# Altium schematic sheet TestDeviceSch_Sheet1.SchDoc: Test Device
size 420 x 297 mm; Date: 6 Aug 2026; ApprovedBy: CLASSIFIED; CheckedBy: CLASSIFIED; Author: A. Lytovchenko; CompanyName: CLASSIFIED; DrawnBy: A. Lytovchenko; Engineer: A. Lytovchenko; Organization: CLASSIFIED; Address1: CLASSIFIED; Address2: CLASSIFIED; Address3: CLASSIFIED; Address4: CLASSIFIED; DocumentNumber: CLASSIFIED; Revision: 1; SheetNumber: 1; SheetTotal: 1; PCB_DWG_NO: CLASSIFIED; DOC_NO_FAB_DWG: CLASSIFIED; DOC_NO_ASSY_DWG: CLASSIFIED; DOC_NO_BOM: CLASSIFIED; SCH_SCALE: 1:1; CAGE_CODE: CLASSIFIED; DOC_NO_SCH_DWG: CLASSIFIED; ENG_APP_DATE: 6 Aug 2026; DSN_APP_DATE: 6 Aug 2026; CHK_APP_DATE: CLASSIFIED; Project: CLASSIFIED; DOC_NO_ASSY_: CLASSIFIED; Time: 00:00; Application_BuildNumber: CLASSIFIED
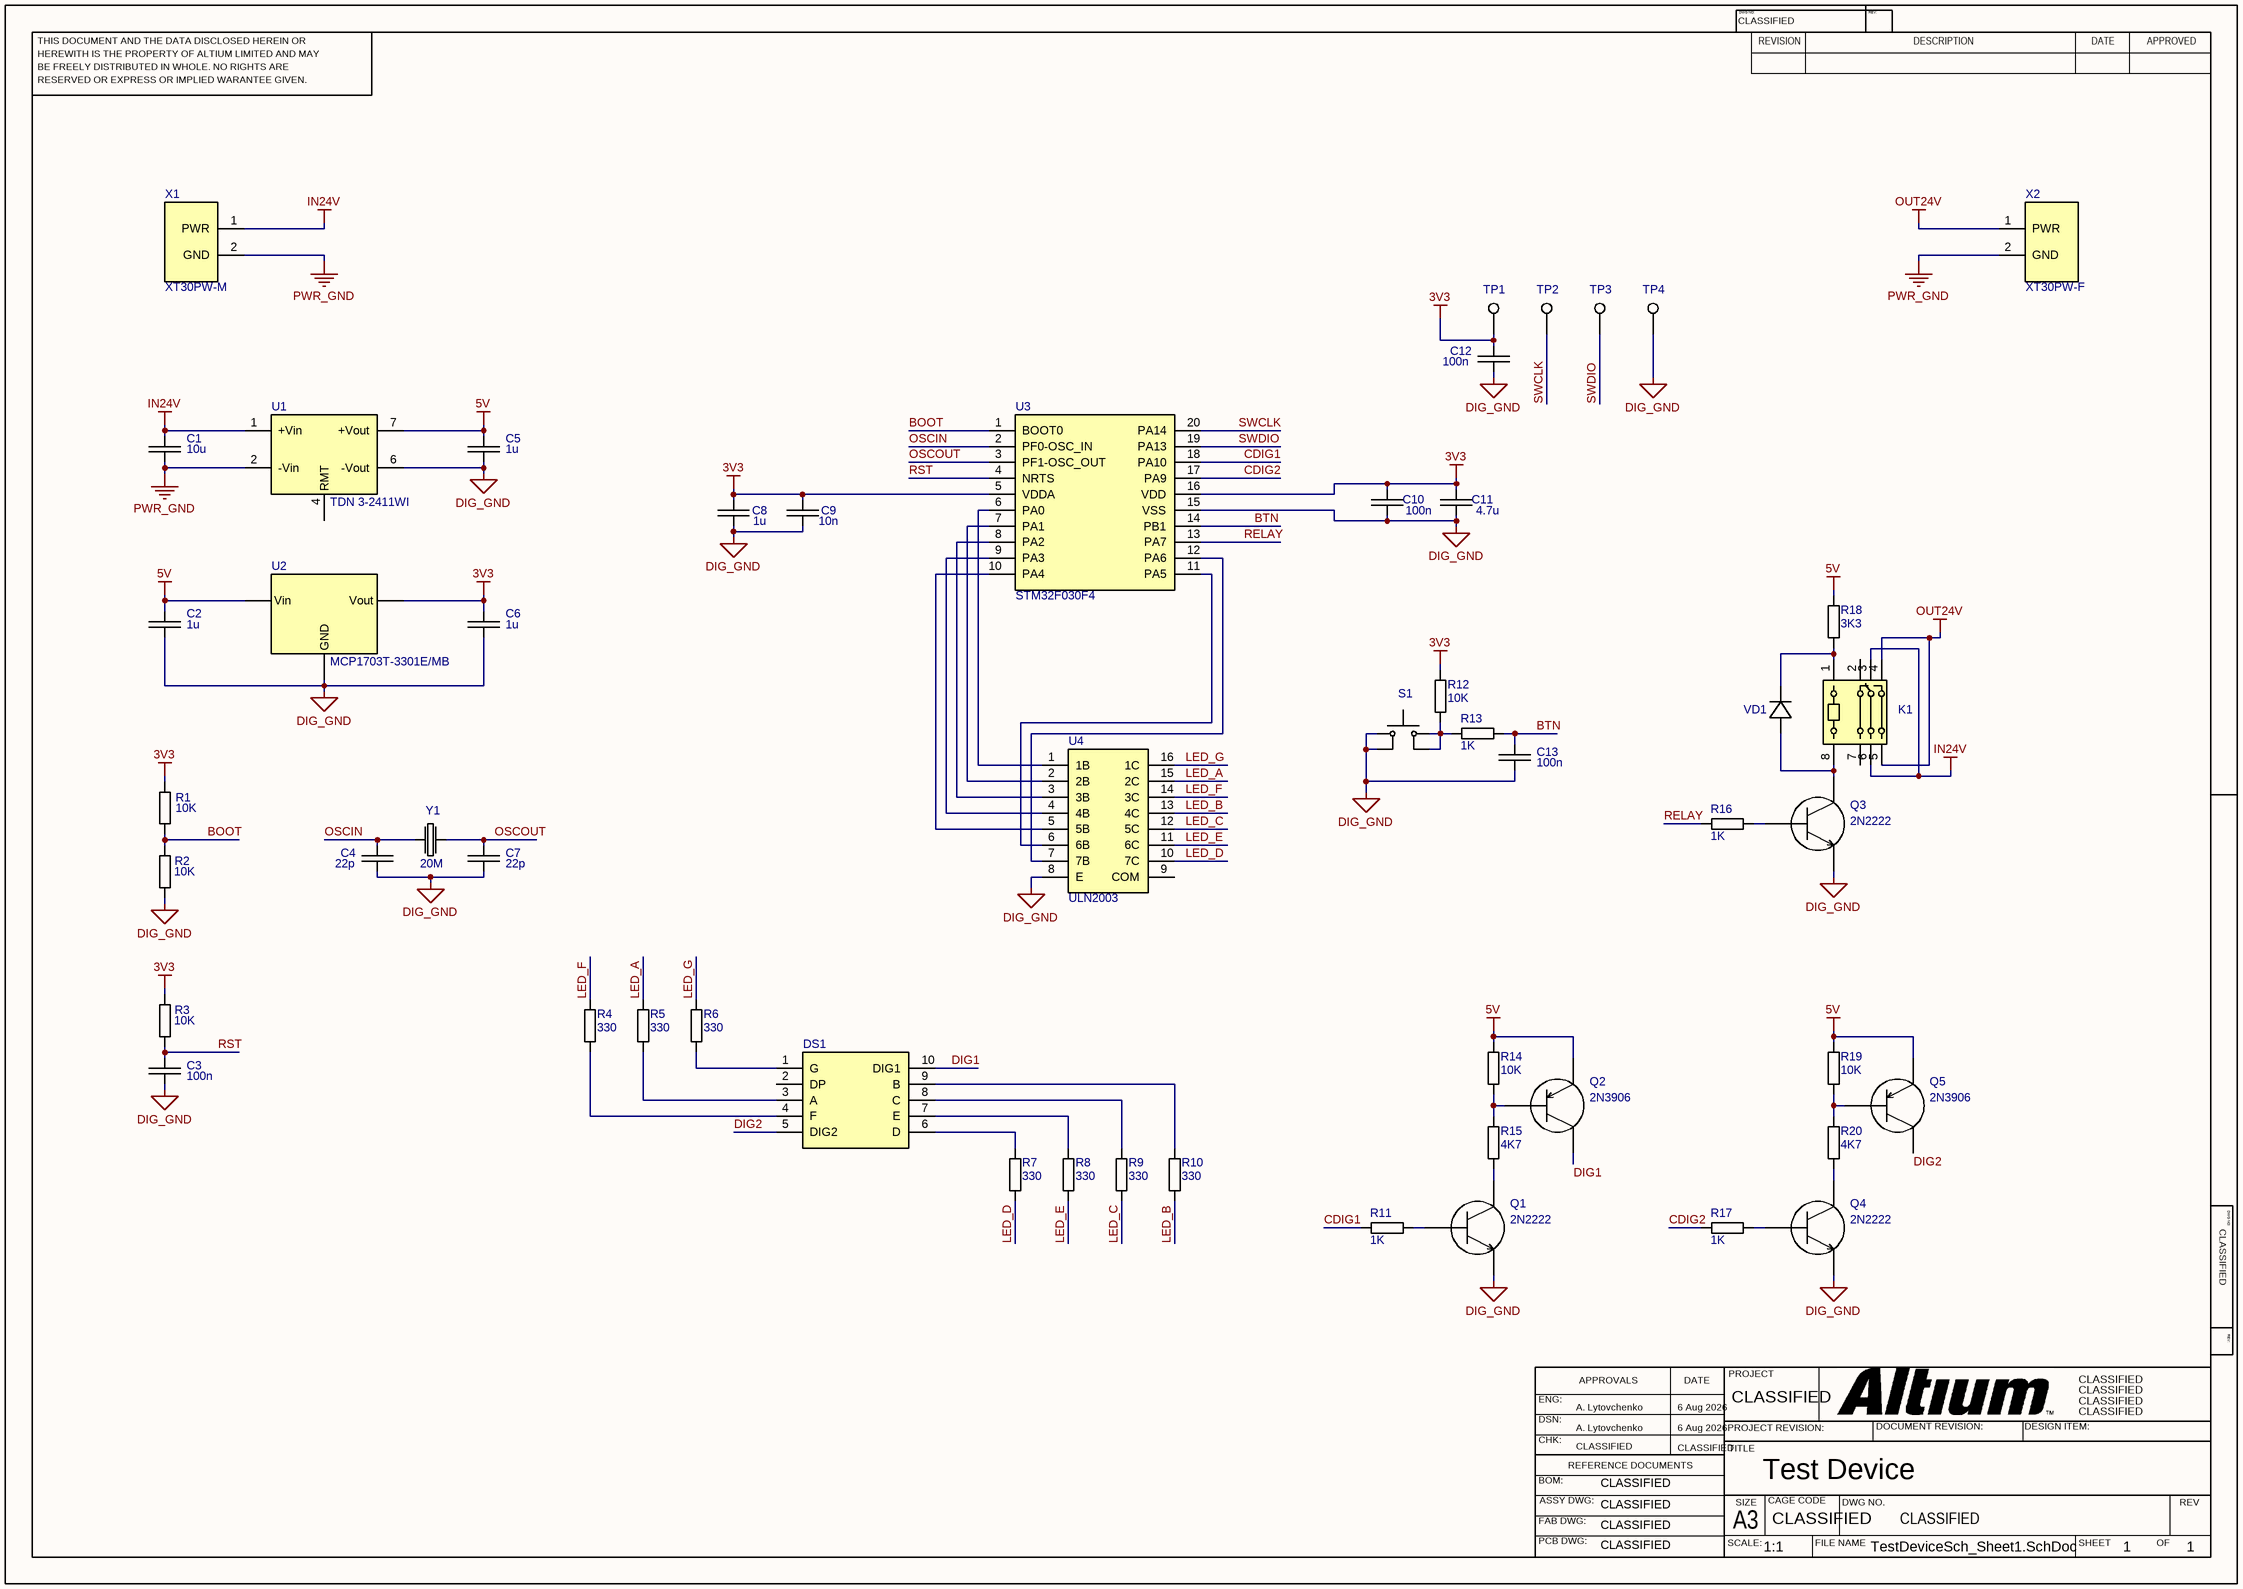
[diagram p0: TestDeviceSch_Sheet1.SchDoc]

## Parts
C1  10u  [C0805]
C2  1u  [C0805]
C3  100n  [C0805]
C4  22p  [C0805]
C5  1u  [C0805]
C6  1u  [C0805]
C7  22p  [C0805]
C8  1u  [C0805]
C9  10n  [C0805]
C10  100n  [C0805]
C11  4.7u  [C0805]
C12  100n  [C0805]
C13  100n  [C0805]
DS1  DISPLAY_7SEG_2DIG_A  [DISPLAY_7SEG_2DIG]  (value not drawn)
K1  JQX-115  [JQX-115F]  (value not drawn)
Q1  2N2222  [TO-92]
Q2  2N3906  [TO-92]
Q3  2N2222  [TO-92]
Q4  2N2222  [TO-92]
Q5  2N3906  [TO-92]
R1  10K  [R0805]
R2  10K  [R0805]
R3  10K  [R0805]
R4  330  [R0805]
R5  330  [R0805]
R6  330  [R0805]
R7  330  [R0805]
R8  330  [R0805]
R9  330  [R0805]
R10  330  [R0805]
R11  1K  [R0805]
R12  10K  [R0805]
R13  1K  [R0805]
R14  10K  [R0805]
R15  4K7  [R0805]
R16  1K  [R0805]
R17  1K  [R0805]
R18  3K3  [R0805]
R19  10K  [R0805]
R20  4K7  [R0805]
S1  PTS125SJM73SMTR-2  [SMD_BUTTON_SPST_12X12]  (value not drawn)
TP1  TEST_POINT  [TEST_POINT]  (value not drawn)  (no BOM)
TP2  TEST_POINT  [TEST_POINT]  (value not drawn)  (no BOM)
TP3  TEST_POINT  [TEST_POINT]  (value not drawn)  (no BOM)
TP4  TEST_POINT  [TEST_POINT]  (value not drawn)  (no BOM)
U1  TDN 3-2411WI  [TDN3WI]
U2  MCP1703T-3301E/MB  [SOT89-3]
U3  STM32F030F4  [TSSOP-20]
U4  ULN2003  [SOIC-16]
VD1  1N4007  [1N4007]  (value not drawn)
X1  XT30PW-M  [XT30PW-M]
X2  XT30PW-F  [XT30PW-F]
Y1  20M  [XTAL]

## Nets
3V3: C6.2 C8.2 C9.2 C10.2 C11.2 C12.2 R1.2 R3.2 R12.1 TP1.1 U2.3(Vout) U3.5(VDDA) U3.16(VDD)
5V: C2.2 C5.2 Q2.1(EMITTER) Q5.1(EMITTER) R14.2 R18.1 R19.2 U1.7(+Vout) U2.2(Vin)
DIG_GND: C2.1 C3.1 C4.1 C5.1 C6.1 C7.1 C8.1 C9.1 C10.1 C11.1 C12.1 C13.1 Q1.3(EMITTER) Q3.3(EMITTER) Q4.3(EMITTER) R2.1 S1.1 S1.2 TP4.1 U1.6(-Vout) U2.1(GND) U3.15(VSS) U4.8(E)
IN24V: C1.1 K1.3 K1.6 U1.1(+Vin) X1.1(PWR)
OUT24V: K1.4 K1.5 X2.1(PWR)
PWR_GND: C1.2 U1.2(-Vin) X1.2(GND) X2.2(GND)
BOOT: R1.1 R2.2 U3.1(BOOT0)
BTN: C13.2 R13.1 U3.14(PB1)
CDIG1: R11.2 U3.18(PA10)
CDIG2: R17.2 U3.17(PA9)
DIG1: DS1.10(DIG1) Q2.3(COLLECTOR)
DIG2: DS1.5(DIG2) Q5.3(COLLECTOR)
LED_A: R5.1 U4.15(2C)
LED_B: R10.2 U4.13(4C)
LED_C: R9.2 U4.12(5C)
LED_D: R7.2 U4.10(7C)
LED_E: R8.2 U4.11(6C)
LED_F: R4.1 U4.14(3C)
LED_G: R6.1 U4.16(1C)
OSCIN: C4.2 U3.2(PF0-OSC_IN) Y1.1
OSCOUT: C7.2 U3.3(PF1-OSC_OUT) Y1.2
RELAY: R16.2 U3.13(PA7)
RST: C3.2 R3.1 U3.4(NRTS)
SWCLK: TP2.1 U3.20(PA14)
SWDIO: TP3.1 U3.19(PA13)
NetDS1_1: DS1.1(G) R6.2
NetDS1_3: DS1.3(A) R5.2
NetDS1_4: DS1.4(F) R4.2
NetDS1_6: DS1.6(D) R7.1
NetDS1_7: DS1.7(E) R8.1
NetDS1_8: DS1.8(C) R9.1
NetDS1_9: DS1.9(B) R10.1
NetK1_1: K1.1 R18.2 VD1.1(C)
NetK1_8: K1.8 Q3.1(COLLECTOR) VD1.2(A)
NetQ1_1: Q1.1(COLLECTOR) R15.1
NetQ1_2: Q1.2(BASE) R11.1
NetQ2_2: Q2.2(BASE) R14.1 R15.2
NetQ3_2: Q3.2(BASE) R16.1
NetQ4_1: Q4.1(COLLECTOR) R20.1
NetQ4_2: Q4.2(BASE) R17.1
NetQ5_2: Q5.2(BASE) R19.1 R20.2
NetR12_2: R12.2 R13.2 S1.3 S1.4
NetU3_6: U3.6(PA0) U4.1(1B)
NetU3_7: U3.7(PA1) U4.2(2B)
NetU3_8: U3.8(PA2) U4.3(3B)
NetU3_9: U3.9(PA3) U4.4(4B)
NetU3_10: U3.10(PA4) U4.5(5B)
NetU3_11: U3.11(PA5) U4.6(6B)
NetU3_12: U3.12(PA6) U4.7(7B)

Not connected (* = marked no-connect by the designer): DS1 2(DP); K1 2 7; U1 4(RMT); U4 9(COM)

## Notes on the sheet
- THIS DOCUMENT AND THE DATA DISCLOSED HEREIN OR
- HEREWITH IS THE PROPERTY OF ALTIUM LIMITED AND MAY
- DWG NO:
- REVISION
- REV:
- DESCRIPTION
- DATE
- APPROVED
- BE FREELY DISTRIBUTED IN WHOLE. NO RIGHTS ARE
- RESERVED OR EXPRESS OR IMPLIED WARANTEE GIVEN.
- ENG:
- APPROVALS
- PROJECT
- DSN:
- CHK:
- REFERENCE DOCUMENTS
- PROJECT REVISION:
- TITLE
- DOCUMENT REVISION:
- DESIGN ITEM:
- BOM:
- FAB DWG:
- PCB DWG:
- ASSY DWG:
- SCALE:
- A3
- SIZE
- CAGE CODE
- FILE NAME
- DWG NO.
- SHEET
- OF
- REV

## Library data of the parts
C1 = C: Manufacturer: Murata; PartNumber: GRM21BR61H106KE43L; Component: Capacitor; Tolerance: 10%; Voltage: 50V; Type: X5R; Value: 10u; Package: 0805
C2 C5 C6 C8 = C: Manufacturer: Murata; PartNumber: GRM21BR71H105KA12L; Component: Capacitor; Tolerance: 5%; Voltage: 50V; Type: X7R; Value: 1u; Package: 0805
C3 C10 C12 C13 = C: Manufacturer: Murata; PartNumber: GRM21BR71H104KA01L; Component: Capacitor; Tolerance: 10%; Voltage: 50V; Type: X7R; Value: 100n; Package: 0805
C4 = C: Manufacturer: YAGEO; PartNumber: CC0805JRNPO9BN220; Component: Capacitor; Tolerance: 5%; Voltage: 50V; Type: C0G; Value: 22p; Package: 0805
C7 = C: Manufacturer: YAGEO; PartNumber: CC0805JRNPO9BN220; Component: Capacitor; Tolerance: 5%; Voltage: 50V; Type: N0G; Value: 22p; Package: 0805
C9 = C: Manufacturer: Murata; PartNumber: GRM2195C1H1103JA01D; Component: Capacitor; Tolerance: 5%; Voltage: 50V; Type: C0G; Value: 10n; Package: 0805
C11 = C: Manufacturer: Murata; PartNumber: GRM21BR61H475KE51L; Component: Capacitor; Tolerance: 10%; Voltage: 50V; Type: X5R; Value: 4.7u; Package: 0805
DS1 = DISPLAY_7SEG_2DIG_A: 7 Segment 2 Digit LED Display with Common Anode; Manufacturer: ARK LED; PartNumber: SN410362; Component: Display
K1 = JQX-115: Miniature High Power Relay; Manufacturer: HONGFA Relay; PartNumber: JQX-115F/0051ZS3AF; Component: Relay
Q1 Q3 Q4 = 2N2222: Amplifier Bipolar NPN Silicon Transistor; PartNumber: P2N2222A; Manufacturer: ON Semiconductor; Component: Bipolar Transistor; Lead: Straight; Package: TO-92
Q2 Q5 = 2N3906: General Purpose Bipolar PNP Silicon Transistor; Manufacturer: ON Semiconductor; Component: Bipolar Transistor; Lead: Straight; PartNumber: 2N3906; Package: TO-92
R1-R3 R12 R14 R19 = R: Manufacturer: YAGEO; PartNumber: RC0805JR-0710KL; Component: Resistor; Tolerance: 5%; Type: -; Value: 10K; Package: 0805
R4-R10 = R: Manufacturer: YAGEO; PartNumber: RC0805JR-07330RL; Component: Resistor; Tolerance: 5%; Type: -; Value: 330; Package: 0805
R11 R13 R16 R17 = R: Manufacturer: YAGEO; PartNumber: RC0805JR-071KL; Component: Resistor; Tolerance: 5%; Type: -; Value: 1K; Package: 0805
R15 R20 = R: Manufacturer: YAGEO; PartNumber: RC0805JR-074K7L; Component: Resistor; Tolerance: 5%; Type: -; Value: 4K7; Package: 0805
R18 = R: Manufacturer: YAGEO; PartNumber: RC0805JR-073K3L; Component: Resistor; Tolerance: 5%; Type: -; Value: 3K3; Package: 0805
S1 = PTS125SJM73SMTR-2: 12 mm x 12 mm Tactile Push Button; Manufacturer: Littelfuse; Component: Switch; PartNumber: PTS125SJM73SMTR-2
U1 = TDN_3WI: Manufacturer: Traco Power; Component: Power Supply; PartNumber: TDN 3-2411WI
U2 = MCP1703: Low Quiescent Current LDO, 250 mA, 16V; Manufacturer: Microchip; Voltage: 3.3V; Component: Voltage Regulator; PartNumber: MCP1703T-3301E/MB; Package: SOT89-3
U3 = STM32F030F4: Manufacturer: STMicroelectronics; Component: Microcontroller; PartNumber: STM32F030F4; Package: TSSOP-20
U4 = ULN2003: High-Voltage, High-Current Darlington Transistor Array; PartNumber: ULN2003ADR; Manufacturer: Texas Instruments; Component: Integrated Circuit; Package: SOIC-16
VD1 = 1N4007: General Purpose Plastic Rectifier; Manufacturer: Vishay; PartNumber: 1N4007-E3/54; Component: Diode
X1 = XT30PW-M: Manufacturer: AMASS; Component: Connector; Gender: Male; PartNumber: XT30PW-M
X2 = XT30PW-F: Manufacturer: AMASS; Component: Connector; Gender: Female; PartNumber: XT30PW-F
Y1 = XTAL: Crystal Oscillator; Manufacturer: IQD; PartNumber: LF XTAL003185; Tolerance: 30ppm; Component: Crystal Oscillator; Voltage: -; Type: -; Value: 20M; Package: THT